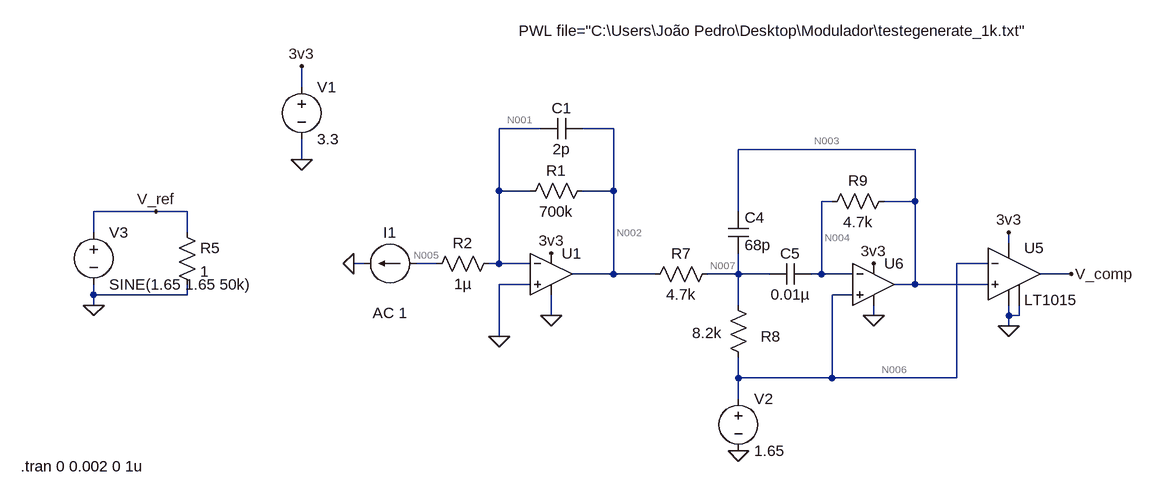
[diagram p0: schematic circuit.asc]
circuit.asc, the LTspice schematic file:
Version 4.1
SHEET 1 1912 1068
WIRE -368 -112 -368 -144
WIRE 0 -48 -64 -48
WIRE 112 -48 64 -48
WIRE 576 -16 304 -16
WIRE -368 0 -368 -32
WIRE -64 48 -64 -48
WIRE -16 48 -64 48
WIRE 112 48 112 -48
WIRE 112 48 64 48
WIRE 448 64 432 64
WIRE 576 64 576 -16
WIRE 576 64 528 64
WIRE -592 80 -688 80
WIRE -544 80 -592 80
WIRE 304 80 304 -16
WIRE -688 112 -688 80
WIRE -544 112 -544 80
WIRE 720 128 720 112
WIRE -272 160 -288 160
WIRE -160 160 -192 160
WIRE -64 160 -64 48
WIRE -64 160 -80 160
WIRE -16 160 -64 160
WIRE 688 160 640 160
WIRE 112 176 112 48
WIRE 112 176 48 176
WIRE 176 176 112 176
WIRE 304 176 304 144
WIRE 304 176 256 176
WIRE 352 176 304 176
WIRE 432 176 432 64
WIRE 432 176 416 176
WIRE 480 176 432 176
WIRE 816 176 768 176
WIRE -16 192 -64 192
WIRE 576 192 576 64
WIRE 576 192 544 192
WIRE 688 192 576 192
WIRE -688 208 -688 192
WIRE -544 208 -544 192
WIRE -544 208 -688 208
WIRE 480 208 448 208
WIRE -688 224 -688 208
WIRE 304 224 304 176
WIRE 16 240 16 208
WIRE 512 240 512 224
WIRE 720 240 720 224
WIRE 736 240 736 224
WIRE 736 240 720 240
WIRE 720 256 720 240
WIRE -64 272 -64 192
WIRE 304 336 304 304
WIRE 448 336 448 208
WIRE 448 336 304 336
WIRE 640 336 640 160
WIRE 640 336 448 336
WIRE 304 368 304 336
FLAG 16 144 3v3
FLAG 16 240 0
FLAG -64 272 0
FLAG -288 160 0
FLAG 816 176 V_comp
FLAG -688 224 0
FLAG -592 80 V_ref
FLAG 720 112 3v3
FLAG 720 256 0
FLAG 512 160 3v3
FLAG 512 240 0
FLAG 304 448 0
FLAG -368 0 0
FLAG -368 -144 3v3
SYMBOL res 80 32 R90
WINDOW 0 0 56 VBottom 2
WINDOW 3 32 56 VTop 2
SYMATTR InstName R1
SYMATTR Value 700k
SYMBOL cap 64 -64 R90
WINDOW 0 0 32 VBottom 2
WINDOW 3 32 32 VTop 2
SYMATTR InstName C1
SYMATTR Value 2p
SYMBOL res -64 144 R90
WINDOW 0 0 56 VBottom 2
WINDOW 3 32 56 VTop 2
SYMATTR InstName R2
SYMATTR Value 1µ
SYMBOL current -192 160 R90
WINDOW 0 -32 40 VBottom 2
WINDOW 3 -374 -552 VTop 2
WINDOW 123 60 40 VTop 2
WINDOW 39 0 0 Left 0
SYMATTR InstName I1
SYMATTR Value PWL file="C:\Users\João Pedro\Desktop\Modulador\testegenerate_1k.txt"
SYMATTR Value2 AC 1
SYMBOL OpAmps\\UniversalOpAmp1 16 176 R0
SYMATTR InstName U1
SYMBOL voltage -688 96 R0
WINDOW 123 0 0 Left 0
WINDOW 39 0 0 Left 0
SYMATTR InstName V3
SYMATTR Value SINE(1.65 1.65 50k)
SYMBOL res -560 96 R0
SYMATTR InstName R5
SYMATTR Value 1
SYMBOL res 272 160 R90
WINDOW 0 0 56 VBottom 2
WINDOW 3 32 56 VTop 2
SYMATTR InstName R7
SYMATTR Value 4.7k
SYMBOL res 320 320 R180
WINDOW 0 -49 48 Left 2
WINDOW 3 41 53 Left 2
SYMATTR InstName R8
SYMATTR Value 8.2k
SYMBOL cap 288 80 R0
WINDOW 0 26 9 Left 2
WINDOW 3 26 51 Left 2
SYMATTR InstName C4
SYMATTR Value 68p
SYMBOL cap 416 160 R90
WINDOW 0 0 32 VBottom 2
WINDOW 3 32 32 VTop 2
SYMATTR InstName C5
SYMATTR Value 0.01µ
SYMBOL res 544 48 R90
WINDOW 0 0 56 VBottom 2
WINDOW 3 32 56 VTop 2
SYMATTR InstName R9
SYMATTR Value 4.7k
SYMBOL OpAmps\\UniversalOpAmp1 512 192 R0
SYMATTR InstName U6
SYMBOL Comparators\\LT1015 720 176 R0
SYMATTR InstName U5
SYMBOL voltage 304 352 R0
WINDOW 123 0 0 Left 0
WINDOW 39 0 0 Left 0
SYMATTR InstName V2
SYMATTR Value 1.65
SYMBOL voltage -368 -128 R0
WINDOW 123 0 0 Left 0
WINDOW 39 0 0 Left 0
SYMATTR InstName V1
SYMATTR Value 3.3
TEXT -800 472 Left 2 !.tran 0 0.002 0 1u

The netlist it stands for:
* circuit.asc
R1 N002 N001 700k
C1 N002 N001 2p
R2 N001 N005 1µ
I1 N005 0 PWL file="C:\Users\João Pedro\Desktop\Modulador\testegenerate_1k.txt" AC 1
X§U1 0 N001 3v3 0 N002 level1 Avol=1Meg GBW=10Meg Vos=0 En=0 Enk=0 In=0 Ink=0 Rin=500Meg  ; pins In+ In- V+ V- OUT
V3 V_ref 0 SINE(1.65 1.65 50k)
R5 V_ref 0 1
R7 N007 N002 4.7k
R8 N006 N007 8.2k
C4 N003 N007 68p
C5 N004 N007 0.01µ
R9 N003 N004 4.7k
X§U6 N006 N004 3v3 0 N003 level1 Avol=1Meg GBW=10Meg Vos=0 En=0 Enk=0 In=0 Ink=0 Rin=500Meg  ; pins In+ In- V+ V- OUT
X§U5 N003 N006 3v3 0 V_comp 0 LT1015  ; pins In+ In- VCC ? OUT+ ?
V2 N006 0 1.65
V1 3v3 0 3.3
.tran 0 0.002 0 1u
.lib UniversalOpAmp1.lib
.lib LT1015.sub
.backanno
.end

* Results of the author's LTspice run, read from the files saved beside the schematic
* Operating Point, zero values left out:
*   V(3v3) = 3.3 V
*   V(n001) = -3.266 µV
*   V(n002) = 3.266 V
*   V(n003) = 1.65 V
*   V(n004) = 1.65 V
*   V(n005) = -3.266 µV
*   V(n006) = 1.65 V
*   V(n007) = 2.677 V
*   V(v_comp) = 1.729 V
*   V(v_ref) = 1.65 V
*   I(I1) = 4.669 µA
*   I(R1) = 4.666 µA
*   I(R2) = 4.669 µA
*   I(R5) = 1.65 A
*   I(R7) = -125.3 µA
*   I(R8) = -125.3 µA
*   I(V1) = -33 mA
*   I(V2) = 125.3 µA
*   I(V3) = -1.65 A
*   Ix(u1:1) = -3.3 nA
*   Ix(u1:2) = -3.3 nA
*   Ix(u1:3) = 6.6 nA
*   Ix(u1:5) = -130 µA
*   Ix(u5:107) = -3.3 nA
*   Ix(u5:2) = -51.16 nA
*   Ix(u5:3) = 15.05 µA
*   Ix(u5:4) = -17.29 nA
*   Ix(u5:6) = -1.455 pA
*   Ix(u5:7) = 33 mA
*   Ix(u6:3) = 3.3 nA
*   Ix(u6:4) = -3.3 nA
*   Ix(u6:5) = -15.05 µA